# EAGLE design ai_robocarpi_linesensor (EAGLE 7.1.0)
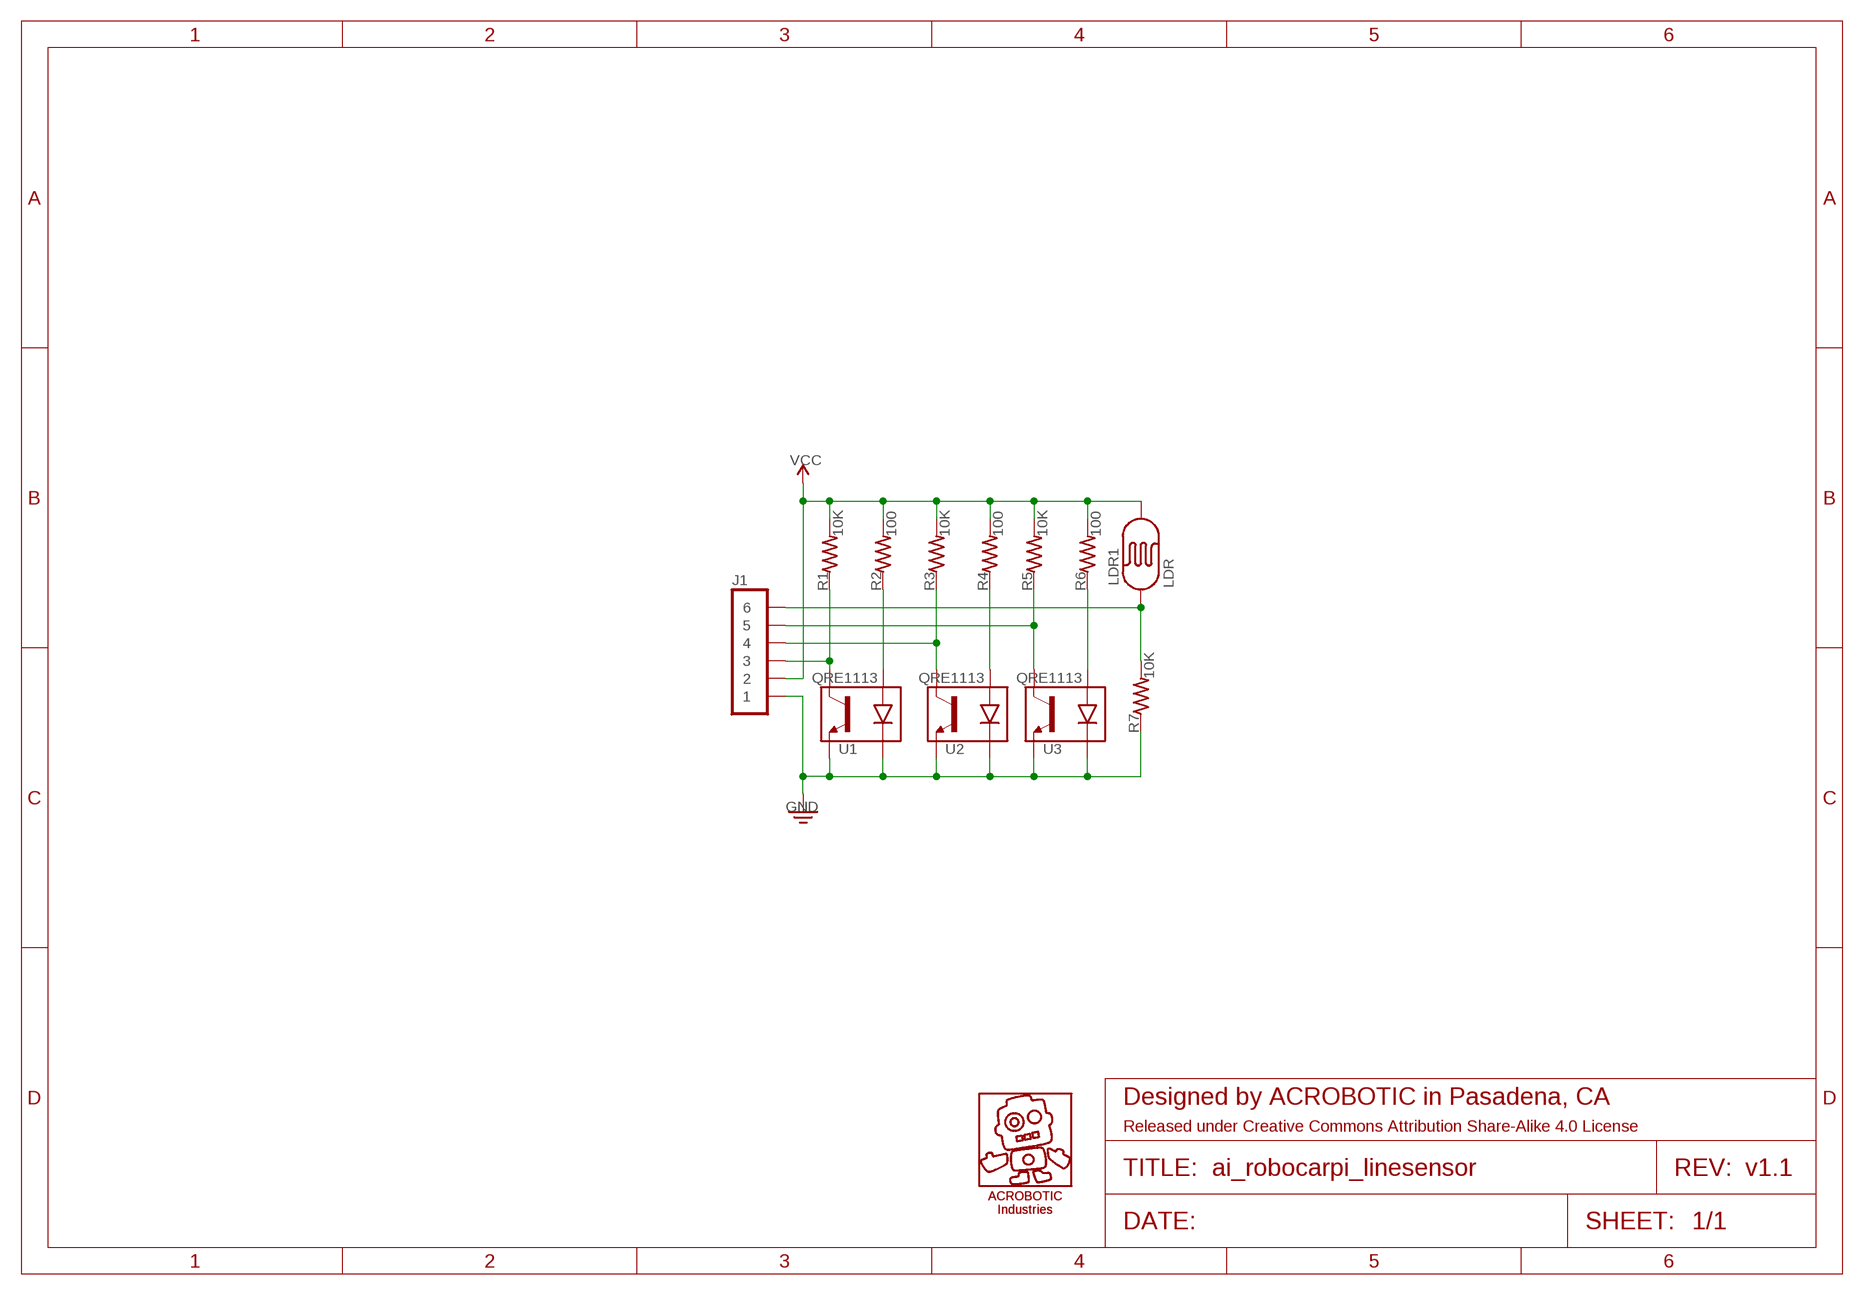
[diagram p0: schematic, sheet 1]

## Parts
FRAME1  FRAME-LETTER  [CREATIVE-COMMONS]
J1  1X06  [1X06]
LDR1  LDR-PTH  [LDR]
R1  10K  RES0603  [RES-0603]
R2  100  RES0603  [RES-0603]
R3  10K  RES0603  [RES-0603]
R4  100  RES0603  [RES-0603]
R5  10K  RES0603  [RES-0603]
R6  100  RES0603  [RES-0603]
R7  10K  RES0603  [RES-0603]
U1  QRE1113  [QRE1113]
U2  QRE1113  [QRE1113]
U3  QRE1113  [QRE1113]
U$4  AI-LOGOXS  [AI-LOGO-XS]
U$5  AI-LOGOXS  [AI-LOGO-XS]

## Nets
C: J1.4 R3.1 U2.3(CO)
GND: J1.1 R7.1 U1.2(CA) U1.4(E) U2.2(CA) U2.4(E) U3.2(CA) U3.4(E)
L: J1.3 R1.1 U1.3(CO)
LDR: J1.6 LDR1.1 R7.2
N$1: R2.1 U1.1(A)
N$4: R4.1 U2.1(A)
N$6: R6.1 U3.1(A)
R: J1.5 R5.1 U3.3(CO)
VCC: J1.2 LDR1.2 R1.2 R2.2 R3.2 R4.2 R5.2 R6.2

## Library data of the parts
FRAME1 = Ai_Miscellany:FRAME-LETTER: Schematic Frame A4 (8.5x11) US Letter frame based on the built-in A4-LOC frame.; REV: v1.1
J1 = Ai_Connectors:1X06
LDR1 = Ai_Sensors:LDR
R1-R7 = Ai_Passives:RES
U1-U3 = Ai_Sensors:QRE1113
U$4 U$5 = Ai_Miscellany:AI-LOGO

## Board
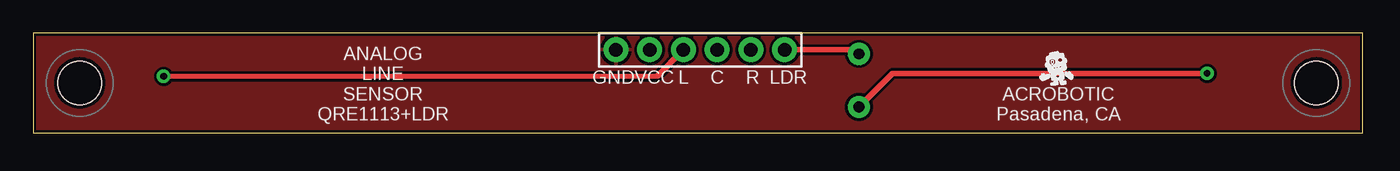
[diagram p1: board, top side]
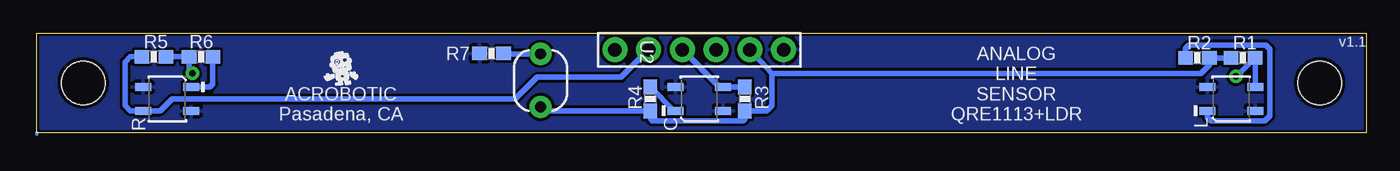
[diagram p2: board, bottom side, seen from below]

Size 100 x 7.5 mm. Coordinates in mm from the lower left corner, seen from the top.
Outline: 0,7.5 0,0 100,0 100,7.5 0,7.5
Copper layers (1*16): Top 0.035mm / dielectric 1.5mm / Bottom 0.035mm
Design rules "ai_2layer": minimum track width 7mil, minimum drill 15mil, track to track 8mil, track to pad 8mil, pad to pad 8mil, via to via 8mil, smd to smd 8mil, copper to edge 8mil, drill to drill 8mil, minimum pad ring 12mil, minimum via ring 10mil, stop-mask expansion 4mil, vias tented up to drill 20mil, thermal gap 10mil

### Footprints (pad centres in the part's own frame; a part is rotated, then mirrored left to right if it is on the bottom)
1X06 = drill 1.016 pad 1.88: 1 -6.35,0; 2 -3.81,0; 3 -1.27,0; 4 1.27,0; 5 3.81,0; 6 6.35,0
LDR = drill 0.8 pad 1.676: 1 -2,0; 2 2,0
RES-0603 = smd 1.1 x 1: 1 -0.9,0; 2 0.9,0
QRE1113 = smd 1.2 x 0.6: 1 -1.8,-0.9; 2 1.8,-0.9; 3 1.8,0.9; 4 -1.8,0.9
STAND-OFF-4 = hole 3.302: 0,0

### Placement (x,y rotation side)
FRAME1  50.31,-1.77 0 top
J1  50.16,6.25 0 top
LDR1  62.1,3.94 270 bottom
R1  9.27,5.64 180 bottom
R2  12.7,5.64 0 bottom
R3  46.74,2.54 270 bottom
R4  53.85,2.54 270 bottom
R5  91.19,5.71 0 bottom
R6  87.63,5.71 180 bottom
R7  65.79,5.97 0 bottom
U1  10.16,2.54 0 bottom
U2  50.16,2.54 0 bottom
U3  90.17,2.54 180 bottom
U$2  [STAND-OFF-4]  3.5,3.75 0 top
U$3  [STAND-OFF-4]  96.5,3.75 0 top
U$4  77.09,4.83 0 bottom
U$5  76.96,4.83 0 top

### Tracks (layer width: path | path; a pad name or v marks a point on that pad's centre or on a via)
C
  Bottom 0.406: R3.1 U2.3 48.63,3.44 J1.4
GND
  pour Top: 0,0 100,0 100,7.5 0,7.5
  pour Bottom: 0,0 100,0 100,7.5 0,7.5
L  (via drill 0.51)
  Top 0.406: v9.8,4.24 46.97,4.27 J1.3
  Bottom 0.406: U1.3 8.36,5.7 R1.1 8.37,5.6 v9.8,4.24
LDR
  Top 0.406: J1.6 61.79,6.25 LDR1.1
  Bottom 0.406: LDR1.1 64.85,5.94 R7.2
N$1
  Bottom 0.406: U1.1 11.96,1.17 11.68,0.89 7.62,0.89 7.24,1.27 7.24,6.3 7.57,6.6 13.34,6.6 13.59,6.35 13.59,5.73 R2.1
N$4
  Bottom 0.406: U2.1 52.05,1.64 R4.1
N$6
  Bottom 0.406: U3.1 86.98,3.44 86.74,3.68 R6.1
N$8
  Bottom 0.254: 100,-0.13 100,0
R
  Bottom 0.406: R5.1 92.96,5.71 93.34,5.33 93.34,2.03 92.95,1.64 U3.3 90.69,1.64 89.79,2.54 64.01,2.54 62.36,4.19 56.03,4.19 J1.5
VCC  (via drill 0.51)
  Top 0.406: v88.29,4.47 64.64,4.47 LDR1.2
  Bottom 0.406: R1.2 R2.2 11.8,5.09 12.45,4.45 44.58,4.45 | 44.58,4.45 44.68,4.45 J1.2 | 44.58,4.45 44.7,4.32 44.7,2.03 45.1,1.64 R3.2 46.74,1.02 46.86,0.89 53.72,0.89 53.85,1.02 R4.2 61.93,1.64 LDR1.2 | R5.2 R6.2 88.53,4.71 v88.29,4.47

### Text on the board
tPlace: ANALOG / LINE / SENSOR / QRE1113+LDR | GND | VCC | L | C | R | LDR | ACROBOTIC / Pasadena, CA
bPlace: v1.1 | ANALOG / LINE / SENSOR / QRE1113+LDR | ACROBOTIC / Pasadena, CA
bNames: L | C | R
tDocu: @MakerBro